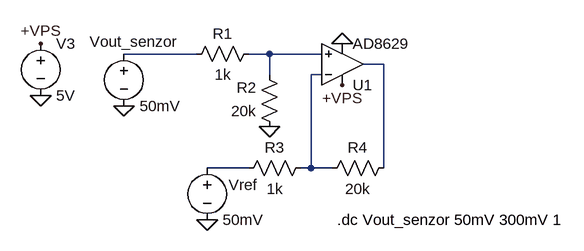
[diagram p0: schematic circuit_proiect.asc]
circuit_proiect.asc, the LTspice schematic file:
Version 4
SHEET 1 928 680
WIRE 0 144 -112 144
WIRE 112 144 80 144
WIRE 192 144 112 144
WIRE 288 160 256 160
WIRE 112 176 112 144
WIRE 192 176 176 176
WIRE 80 320 16 320
WIRE 176 320 176 176
WIRE 176 320 160 320
WIRE 208 320 176 320
WIRE 288 320 288 160
FLAG 112 256 0
FLAG 224 128 0
FLAG -240 208 0
FLAG -240 128 +VPS
FLAG 224 192 +VPS
FLAG -112 224 0
FLAG 16 400 0
SYMBOL res 96 128 R90
WINDOW 0 0 56 VBottom 2
WINDOW 3 32 56 VTop 2
SYMATTR InstName R1
SYMATTR Value 1k
SYMBOL res 128 272 R180
WINDOW 0 36 76 Left 2
WINDOW 3 36 40 Left 2
SYMATTR InstName R2
SYMATTR Value 20k
SYMBOL res 64 336 R270
WINDOW 0 32 56 VTop 2
WINDOW 3 0 56 VBottom 2
SYMATTR InstName R3
SYMATTR Value 1k
SYMBOL res 192 336 R270
WINDOW 0 32 56 VTop 2
WINDOW 3 0 56 VBottom 2
SYMATTR InstName R4
SYMATTR Value 20k
SYMBOL voltage -112 128 R0
WINDOW 0 -53 -3 Left 2
SYMATTR InstName Vout_senzor
SYMATTR Value 50mV
SYMBOL voltage 16 304 R0
WINDOW 123 0 0 Left 0
WINDOW 39 0 0 Left 0
WINDOW 0 33 42 Left 2
SYMATTR InstName Vref
SYMATTR Value 50mV
SYMBOL voltage -240 112 R0
SYMATTR InstName V3
SYMATTR Value 5V
SYMBOL OpAmps\\AD8629 224 224 M180
SYMATTR InstName U1
TEXT 216 400 Left 2 !.dc Vout_senzor 50mV 300mV 1

The netlist it stands for:
* circuit_proiect.asc
R1 N002 N001 1k
R2 0 N002 20k
R3 N005 N004 1k
R4 N004 N003 20k
Vout_senzor N001 0 50mV
Vref N005 0 50mV
V3 +VPS 0 5V
XU1 N002 N004 +VPS 0 N003 AD8629  ; pins In+ In- V+ V- OUT
.dc Vout_senzor 50mV 300mV 1
.backanno
.end